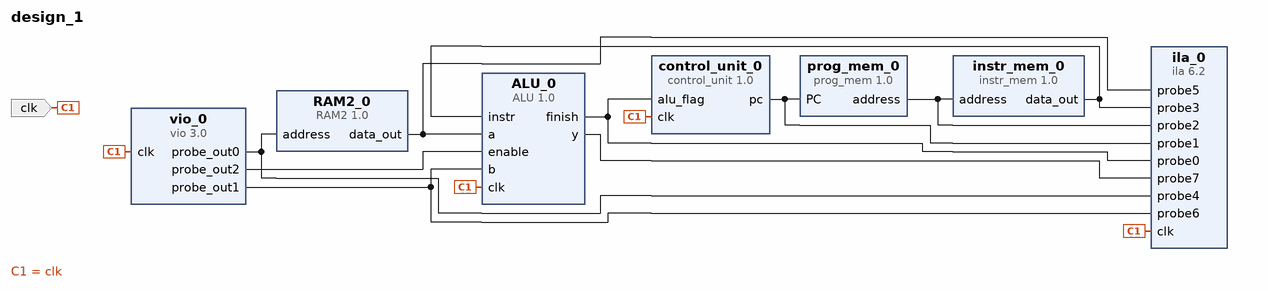
[diagram p0: block diagram of the top level]
# Vivado block design design_1, xc7z010clg400-1, Vivado 2020.1
create_bd_design design_1

create_bd_port -dir I -type clk clk

create_bd_cell -type ip -vlnv xilinx.com:user:prog_mem:1.0 prog_mem_0
create_bd_cell -type ip -vlnv xilinx.com:user:instr_mem:1.0 instr_mem_0
create_bd_cell -type ip -vlnv xilinx.com:user:control_unit:1.0 control_unit_0
create_bd_cell -type ip -vlnv xilinx.com:user:RAM2:1.0 RAM2_0
create_bd_cell -type ip -vlnv xilinx.com:ip:vio:3.0 vio_0
set_property -dict [list \
  CONFIG.C_NUM_PROBE_IN 0 \
  CONFIG.C_NUM_PROBE_OUT 3 \
  CONFIG.C_PROBE_OUT0_WIDTH 4 \
  CONFIG.C_PROBE_OUT1_WIDTH 4 \
] [get_bd_cells vio_0]
create_bd_cell -type ip -vlnv xilinx.com:ip:ila:6.2 ila_0
set_property -dict [list \
  CONFIG.C_ENABLE_ILA_AXI_MON false \
  CONFIG.C_MONITOR_TYPE Native \
  CONFIG.C_NUM_OF_PROBES 8 \
  CONFIG.C_PROBE1_WIDTH 2 \
  CONFIG.C_PROBE2_WIDTH 4 \
  CONFIG.C_PROBE3_WIDTH 4 \
  CONFIG.C_PROBE4_WIDTH 4 \
  CONFIG.C_PROBE5_WIDTH 4 \
  CONFIG.C_PROBE6_WIDTH 4 \
  CONFIG.C_PROBE7_WIDTH 4 \
] [get_bd_cells ila_0]
create_bd_cell -type ip -vlnv xilinx.com:user:ALU:1.0 ALU_0

# ---- connections ----

connect_bd_net [get_bd_pins RAM2_0/data_out] [get_bd_pins ila_0/probe5] [get_bd_pins ALU_0/a]
connect_bd_net [get_bd_pins prog_mem_0/address] [get_bd_pins instr_mem_0/address] [get_bd_pins ila_0/probe2]
connect_bd_net [get_bd_pins instr_mem_0/data_out] [get_bd_pins ila_0/probe3] [get_bd_pins ALU_0/instr]
connect_bd_net [get_bd_pins control_unit_0/pc] [get_bd_pins prog_mem_0/PC] [get_bd_pins ila_0/probe1]
connect_bd_net [get_bd_pins ALU_0/finish] [get_bd_pins control_unit_0/alu_flag] [get_bd_pins ila_0/probe0]
connect_bd_net -net clk_0_1 [get_bd_ports clk] \
  [get_bd_pins control_unit_0/clk] [get_bd_pins vio_0/clk] [get_bd_pins ila_0/clk] [get_bd_pins ALU_0/clk]
connect_bd_net [get_bd_pins ALU_0/y] [get_bd_pins ila_0/probe7]
connect_bd_net [get_bd_pins vio_0/probe_out0] [get_bd_pins RAM2_0/address] [get_bd_pins ila_0/probe4]
connect_bd_net [get_bd_pins vio_0/probe_out1] [get_bd_pins ila_0/probe6] [get_bd_pins ALU_0/b]
connect_bd_net [get_bd_pins vio_0/probe_out2] [get_bd_pins ALU_0/enable]

validate_bd_design
save_bd_design
